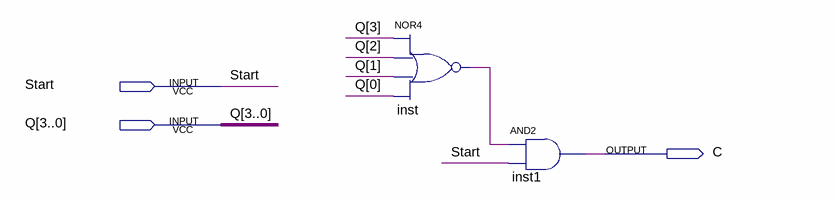
[diagram p0: schematic sheet]
// Quartus schematic OutputBlock.bdf as structural Verilog: 2 symbols, 3 pins
module OutputBlock (
  input  Start,
  input  [3:0] Q,
  output C
);

  wire inst_out;

  nor inst (inst_out, Q[3], Q[2], Q[1], Q[0]);
  and inst1 (C, inst_out, Start);
endmodule
